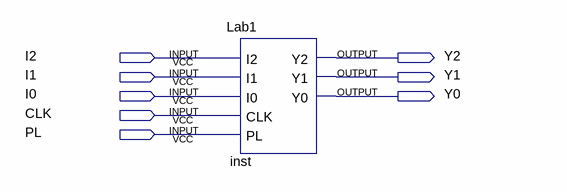
[diagram p0: schematic sheet]
// Quartus schematic Block4.bdf as structural Verilog: 1 symbols, 8 pins
module Block4 (
  input  I2,
  input  I1,
  input  I0,
  input  CLK,
  input  PL,
  output Y2,
  output Y1,
  output Y0
);

  Lab1 inst (.I2(I2), .I1(I1), .I0(I0), .CLK(CLK), .PL(PL), .Y2(Y2), .Y1(Y1), .Y0(Y0));
endmodule
